# EAGLE design clock generator (EAGLE 9.3.1)
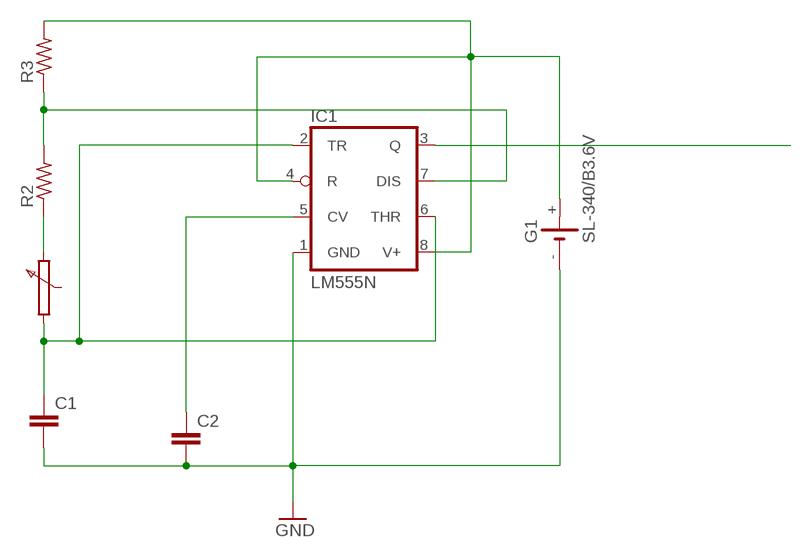
[diagram p0: schematic, sheet 1]

## Parts
C1  C2,5-3  [C2.5-3]
C2  C2,5-3  [C2.5-3]
G1  SL-340/B3.6V  [SL-340/B3.6V]
IC1  LM555N  [DIL08-ROUND]
R2  R-US_0204/7  [0204/7]
R3  R-US_0204/7  [0204/7]

## Nets
GND: C1.2 C2.2 G1.- IC1.1(GND)
N$1: G1.+ IC1.4(R) IC1.8(V+) R3.2
N$2: C1.1 IC1.2(TR) IC1.6(THR)
N$3: R2.1
N$4: C2.1 IC1.5(CV)
N$5: IC1.7(DIS) R2.2 R3.1
N$6: IC1.3(Q)

## Library data of the parts
C1 C2 = capacitor-wima:C: CAPACITOR naming: grid - package width
G1 = battery:SL-340/B3.6V: LI BATTERY Sonnenschein
IC1 = adafruit:*555: TIMER Changed DIP package to have round (not oval) pin pads http://www.ladyada.net/library/pcb/eaglelibrary.html
R2 R3 = adafruit:R-US_: RESISTOR, American symbol

## Board
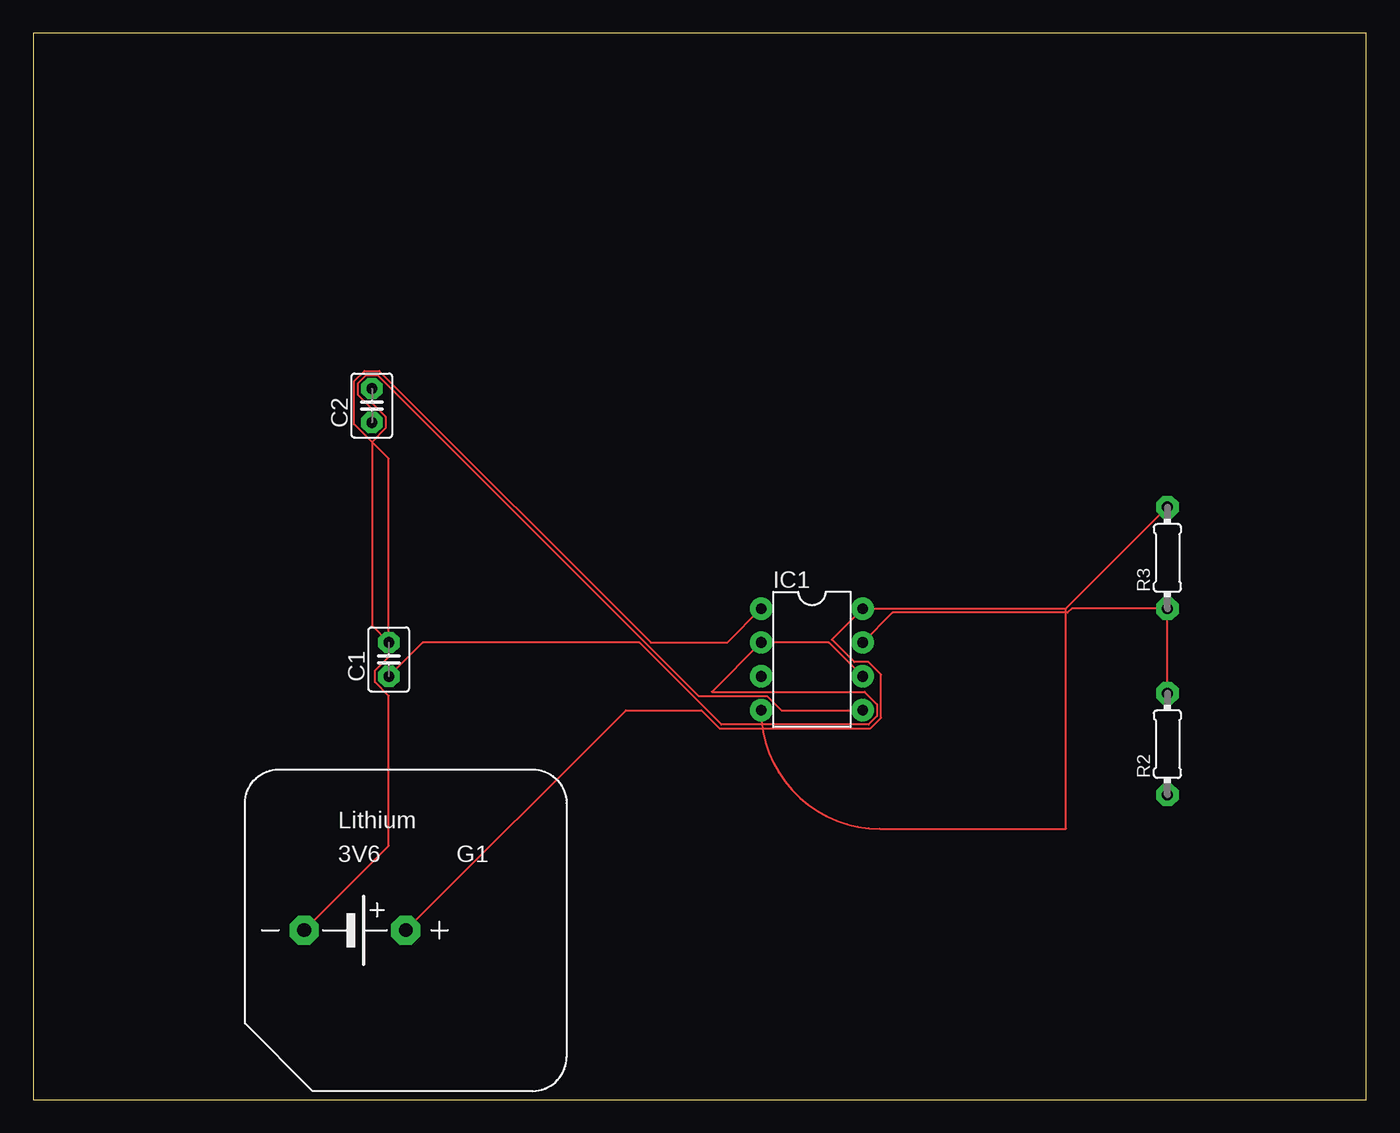
[diagram p1: board, top side]

Size 100 x 80 mm. Coordinates in mm from the lower left corner, seen from the top.
Outline: 0,0 100,0 100,80 0,80 0,0
Copper layers (1*16): Top 0.035mm / dielectric 1.5mm / Bottom 0.035mm
Design rules "default": minimum track width 6mil, minimum drill 0.35mm, track to track 6mil, track to pad 6mil, pad to pad 6mil, via to via 6mil, smd to smd 6mil, copper to edge 40mil, drill to drill 6mil, minimum pad ring 10mil, minimum via ring 8mil, stop-mask expansion 4mil, vias tented up to drill 0mil, thermal gap 10mil

### Footprints (pad centres in the part's own frame; a part is rotated, then mirrored left to right if it is on the bottom)
C2.5-3 = drill 0.813 pad 1.6 octagon: 1 -1.27,0; 2 1.27,0
SL-340/B3.6V = drill 1.016 pad 2.159 octagon: + 0,0; - -7.62,0
DIL08-ROUND = drill 0.813 pad 1.676: 1 -3.81,-3.81; 2 -1.27,-3.81; 3 1.27,-3.81; 4 3.81,-3.81; 5 3.81,3.81; 6 1.27,3.81; 7 -1.27,3.81; 8 -3.81,3.81
0204/7 = drill 0.813 pad 1.676 octagon: 1 -3.81,0; 2 3.81,0

### Placement (x,y rotation side)
C1  26.67,33.02 90 top
C2  25.4,52.07 90 top
G1  27.94,12.7 0 top
IC1  58.42,33.02 270 top
R2  85.09,26.67 90 top
R3  85.09,40.64 90 top

### Tracks (layer width: path | path; a pad name or v marks a point on that pad's centre or on a via)
GND
  Top 0.152: C1.2 25.4,35.56 25.4,49.34 26.43,50.37 26.43,51.23 25.4,52.26 C2.2 | IC1.1 52.07,34.29 46.34,34.29 25.95,54.67 24.85,54.67 24.07,53.89 24.07,50.68 26.67,48.08 C1.2 | G1.- 26.67,19.05 26.67,30.3 25.64,31.32 25.64,32.18 26.67,33.2 C1.2
N$1
  Top 0.152: 77.47,36.83 IC1.8 59.91,34.51 61.59,32.82 62.67,32.82 63.6,31.89 63.6,28.64 62.8,27.84 51.49,27.84 50.12,29.21 44.45,29.21 G1.+ | 77.47,36.83 R3.2 | IC1.4 arc90 63.5,20.32 77.47,20.32 77.47,36.83
N$2
  Top 0.152: IC1.6 59.69,34.29 IC1.2 50.9,30.58 62.37,30.58 63.3,29.65 63.3,28.77 62.67,28.14 51.62,28.14 45.47,34.29 29.21,34.29 C1.1
N$4
  Top 0.152: IC1.5 56.12,29.21 55.05,30.28 49.92,30.28 25.83,54.37 24.97,54.37 24.37,53.77 24.37,52.85 25.4,51.82 C2.1
N$5
  Top 0.152: IC1.7 64.47,36.52 77.6,36.52 77.9,36.83 R3.1 R2.2